# Altium schematic sheet 02_AFE.SchDoc
size Letter
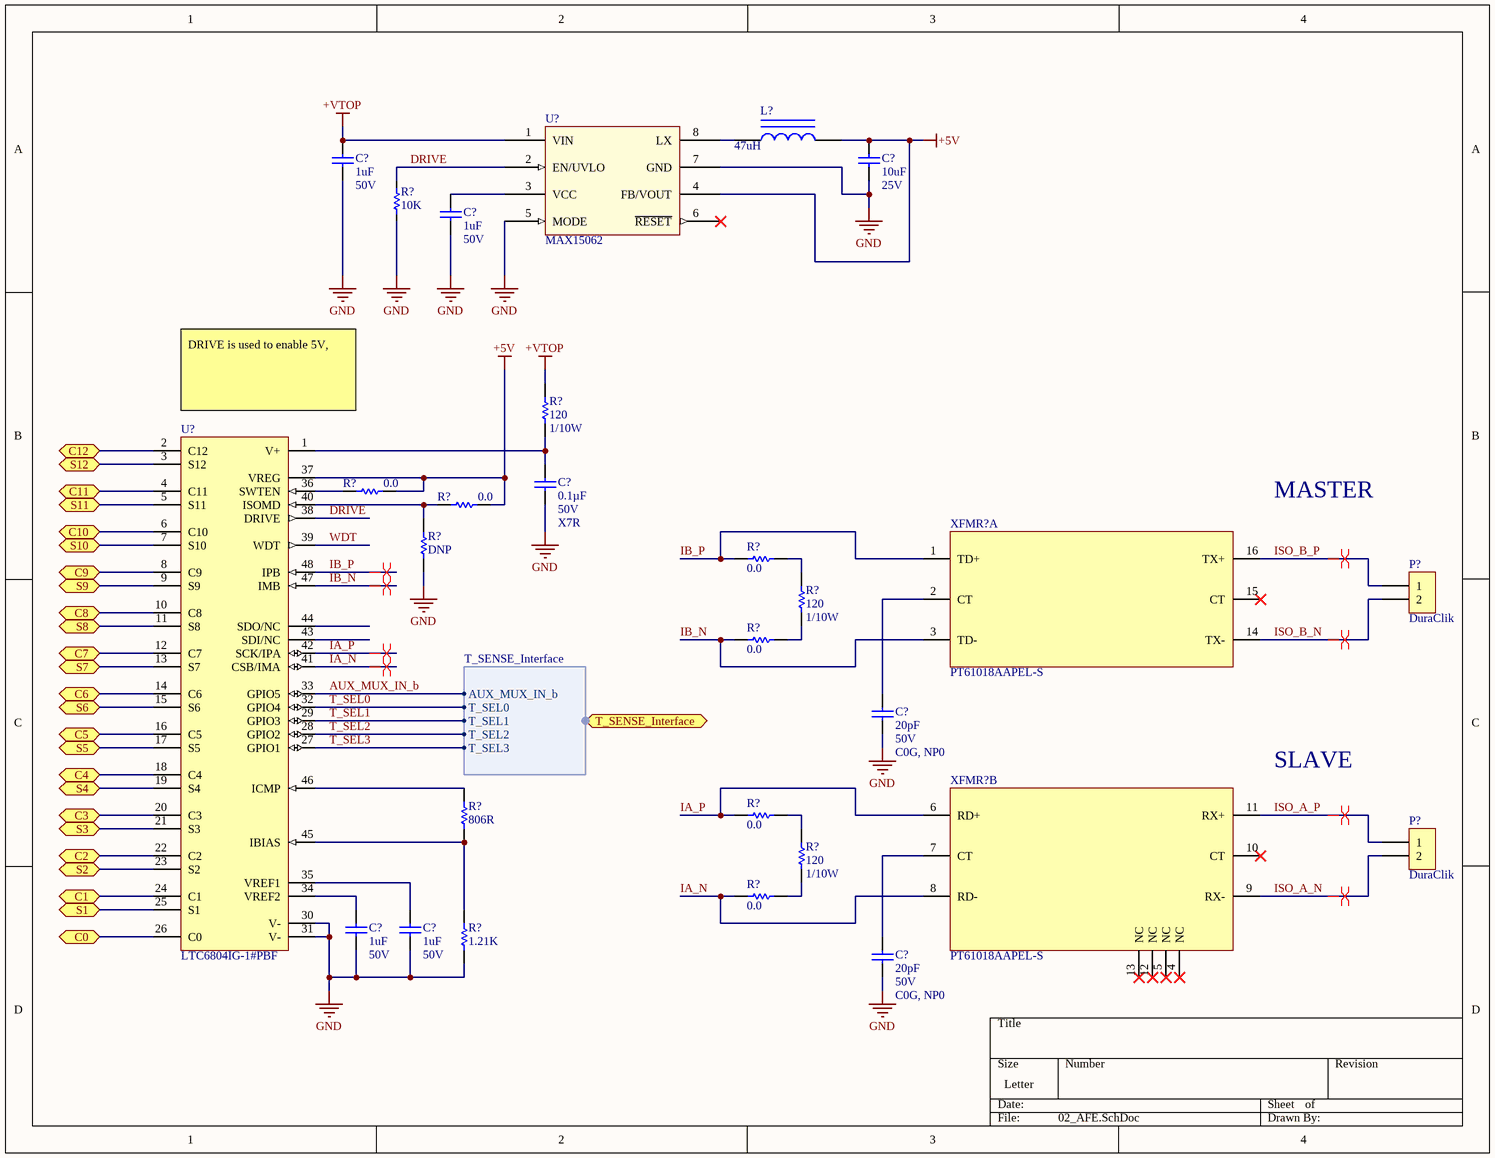
[diagram p0: 02_AFE.SchDoc]

## Parts
(Parts that share a designator on the sheet are numbered #1, #2 ... from top to bottom, then left to right.)
C?#1  1uF  Voltage: 50V  [CAPC1608X06N]
C?#2  10uF  Voltage: 25V  [CAPC1608X06N]
C?#3  1uF  Voltage: 50V  [CAPC1608X06N]
C?#4  Capacitance: 0.1µF  Voltage: 50V  Temperature Coefficient: X7R  [CAP, 0603]  (hidden comment: CAP CER 0.1UF 50V 10% X7R 0603)
C?#5  Capacitance: 20pF  Voltage: 50V  Temperature Coefficient: C0G, NP0  [CAP, 0603]  (hidden comment: CAP CER 20PF 50V ±5% C0G/NP0 0603)
C?#6  1uF  Voltage: 50V  [CAPC1608X06N]
C?#7  1uF  Voltage: 50V  [CAPC1608X06N]
C?#8  Capacitance: 20pF  Voltage: 50V  Temperature Coefficient: C0G, NP0  [CAP, 0603]  (hidden comment: CAP CER 20PF 50V ±5% C0G/NP0 0603)
L?  value 47uH  [AXIAL-0.9]  (hidden comment: nductor Iron)
P?#1  Series: DuraClik  [CONN, 2POS Dura-Click]  (hidden comment: CONN 2POS DURA-CLIK 0.079")
P?#2  Series: DuraClik  [CONN, 2POS Dura-Click]  (hidden comment: CONN 2POS DURA-CLIK 0.079")
R?#1  10K  [0805]
R?#2  Resistance: 120  Power: 1/10W  [RES, 0603]  (hidden comment: RES 120 OHM 1% 1/10W 0603)
R?#3  Resistance: 0.0  [RES, 0603]  (hidden comment: RES 0.0 OHM 1/4W 0603)
R?#4  Resistance: 0.0  [RES, 0603]  (hidden comment: RES 0.0 OHM 1/4W 0603)
R?#5  Resistance: 0.0  [RES, 0603]  (hidden comment: RES 0.0 OHM 1/4W 0603)
R?#6  Resistance: DNP  [RES, 0603]  (hidden comment: RES 0.0 OHM 1/4W 0603)
R?#7  Resistance: 120  Power: 1/10W  [RES, 0603]  (hidden comment: RES 120 OHM 1% 1/10W 0603)
R?#8  Resistance: 0.0  [RES, 0603]  (hidden comment: RES 0.0 OHM 1/4W 0603)
R?#9  Resistance: 0.0  [RES, 0603]  (hidden comment: RES 0.0 OHM 1/4W 0603)
R?#10  value 806R  [AXIAL-0.3]  (hidden comment: Res1)
R?#11  Resistance: 120  Power: 1/10W  [RES, 0603]  (hidden comment: RES 120 OHM 1% 1/10W 0603)
R?#12  Resistance: 0.0  [RES, 0603]  (hidden comment: RES 0.0 OHM 1/4W 0603)
R?#13  value 1.21K  [AXIAL-0.3]  (hidden comment: Res1)
U?#1  MAX15062
U?#2  Manufacturer Part Number 1: LTC6804IG-1#PBF  (hidden comment: IC MONITOR BATT STACK 48SSOP)
XFMR?#1  MFG_PN: PT61018AAPEL-S  [IC, PULSE XFMR 1CT:1CT 350UH SMD]  (hidden comment: IC PULSE XFMR 1CT:1CT 350UH SMD)  (part A of 2)
XFMR?#2  MFG_PN: PT61018AAPEL-S  [IC, PULSE XFMR 1CT:1CT 350UH SMD]  (hidden comment: IC PULSE XFMR 1CT:1CT 350UH SMD)  (part B of 2)

## Ports
C0, C1, C2, C3, C4, C5, C6, C7, C8, C9, C10, C11, C12, S1, S2, S3, S4, S5, S6, S7, S8, S9, S10, S11, S12, T_SENSE_Interface (harness T_SENSE_Interface)

## Harnesses
T_SENSE_Interface: AUX_MUX_IN_b, T_SEL0, T_SEL1, T_SEL2, T_SEL3

## Nets
+5V: C?#2.2 L?.2 R?#3.1 R?#4.2 U?#1.4(FB/VOUT) U?#2.37(VREG)
+VTOP: C?#1.2 R?#2.2 U?#1.1(VIN)
GND: C?#1.1 C?#2.1 C?#3.1 C?#4.2 C?#5.2 C?#6.1 C?#7.1 C?#8.2 R?#1.1 R?#6.1 R?#13.2 U?#1.5(MODE) U?#1.7(GND) U?#2.30(V-) U?#2.31(V-)
AUX_MUX_IN_b: U?#2.33(GPIO5) ; port T_SENSE_Interface.AUX_MUX_IN_b
C0: U?#2.26(C0) ; port C0
C1: U?#2.24(C1) ; port C1
C2: U?#2.22(C2) ; port C2
C3: U?#2.20(C3) ; port C3
C4: U?#2.18(C4) ; port C4
C5: U?#2.16(C5) ; port C5
C6: U?#2.14(C6) ; port C6
C7: U?#2.12(C7) ; port C7
C8: U?#2.10(C8) ; port C8
C9: U?#2.8(C9) ; port C9
C10: U?#2.6(C10) ; port C10
C11: U?#2.4(C11) ; port C11
C12: U?#2.2(C12) ; port C12
DRIVE: R?#1.2 U?#1.2(EN/UVLO) U?#2.38(DRIVE)
IA_N: R?#12.1 U?#2.41(CSB/IMA) XFMR?#2.8(RD-)
IA_P: R?#9.1 U?#2.42(SCK/IPA) XFMR?#2.6(RD+)
IB_N: R?#8.1 U?#2.47(IMB) XFMR?#1.3(TD-)
IB_P: R?#5.1 U?#2.48(IPB) XFMR?#1.1(TD+)
ISO_A_N: P?#2.2 XFMR?#2.9(RX-)
ISO_A_P: P?#2.1 XFMR?#2.11(RX+)
ISO_B_N: P?#1.2 XFMR?#1.14(TX-)
ISO_B_P: P?#1.1 XFMR?#1.16(TX+)
S1: U?#2.25(S1) ; port S1
S2: U?#2.23(S2) ; port S2
S3: U?#2.21(S3) ; port S3
S4: U?#2.19(S4) ; port S4
S5: U?#2.17(S5) ; port S5
S6: U?#2.15(S6) ; port S6
S7: U?#2.13(S7) ; port S7
S8: U?#2.11(S8) ; port S8
S9: U?#2.9(S9) ; port S9
S10: U?#2.7(S10) ; port S10
S11: U?#2.5(S11) ; port S11
S12: U?#2.3(S12) ; port S12
T_SEL0: U?#2.32(GPIO4) ; port T_SENSE_Interface.T_SEL0
T_SEL1: U?#2.29(GPIO3) ; port T_SENSE_Interface.T_SEL1
T_SEL2: U?#2.28(GPIO2) ; port T_SENSE_Interface.T_SEL2
T_SEL3: U?#2.27(GPIO1) ; port T_SENSE_Interface.T_SEL3
WDT: U?#2.39(WDT)
NetC?#3_2: C?#3.2 U?#1.3(VCC)
NetC?#4_1: C?#4.1 R?#2.1 U?#2.1(V+)
NetC?#5_1: C?#5.1 XFMR?#1.2(CT)
NetC?#6_2: C?#6.2 U?#2.34(VREF2)
NetC?#7_2: C?#7.2 U?#2.35(VREF1)
NetC?#8_1: C?#8.1 XFMR?#2.7(CT)
NetL?_1: L?.1 U?#1.8(LX)
NetR?#3_2: R?#3.2 U?#2.36(SWTEN)
NetR?#4_1: R?#4.1 R?#6.2 U?#2.40(ISOMD)
NetR?#5_2: R?#5.2 R?#7.1
NetR?#7_2: R?#7.2 R?#8.2
NetR?#9_2: R?#9.2 R?#11.1
NetR?#10_1: R?#10.1 R?#13.1 U?#2.45(IBIAS)
NetR?#10_2: R?#10.2 U?#2.46(ICMP)
NetR?#11_2: R?#11.2 R?#12.2

Not connected (* = marked no-connect by the designer): U?#1 6(~{RESET})*; U?#2 43(SDI/NC) 44(SDO/NC); XFMR?#1 15(CT)*; XFMR?#2 4(NC)* 5(NC)* 10(CT)* 12(NC)* 13(NC)*

## Layout directives
differential pair: IA_N, IA_P, IB_N, IB_P, ISO_A_N, ISO_A_P, ISO_B_N, ISO_B_P

## Notes on the sheet
- (near U?#2) DRIVE is used to enable 5V,
- MASTER
- SLAVE

## Library data of the parts
C?#1 C?#3 C?#6 C?#7 = CAP CER 1UF 50V 10% X7R 0603: 1µF ±10% 50V Ceramic Capacitor X7R 0603 (1608 Metric); Manufacturer: Taiyo Yuden; ManufacturerPartNumber: UMK107AB7105KA-T; Value: 1uF; Supplier 1: Digi-Key; Supplier Part Number 1: 587-3247-1-ND
C?#2 = CAP CER 10uF 25V 20% X5R 0603: 10µF ±20% 25V Ceramic Capacitor X5R 0603 (1608 Metric); Manufacturer: Murata Electronics North America; ManufacturerPartNumber: GRM188R61E106MA73D; Value: 10uF; Supplier: Digi-Key; SupplierPartNumber: 490-7202-1-ND
C?#4 = CAP CER 0.1UF 50V 10% X7R 0603: 0.10µF ±10% 50V Ceramic Capacitor X7R 0603 (1608 Metric); Manufacturer 1: AVX Corporation; Manufacturer Part Number 1: 06035C104KAT2A; Supplier 1: Digi-Key; Supplier Part Number 1: 478-5052-1-ND; Packaging: Cut Tape (CT); Part Status: Active; Operating Temperature: -55°C ~ 125°C; Ratings: -; Mounting Type: Surface Mount, MLCC; Package / Case: 0603 (1608 Metric); Size / Dimension: 0.063" L x 0.032" W (1.60mm x 0.81mm); Height - Seated (Max): -; Thickness (Max): 0.035" (0.90mm); Lead Spacing: -; Lead Style: -; ComponentLink1URL: http://datasheets.avx.com/X7RDielectric.pdf; ComponentLink1Description: http://datasheets.avx.com/X7RDielectric.pdf; Tolerance: ±10%
C?#5 C?#8 = CAP CER 20PF 50V ±5% C0G/NP0 0603: 20pF ±5% 50V Ceramic Capacitor C0G, NP0 0603 (1608 Metric); Manufacturer 1: Murata Electronics North America; Manufacturer Part Number 1: GRM1885C1H200JA01D; Supplier 1: Digi-Key; Supplier Part Number 1: 490-1410-1-ND; Packaging: Cut Tape (CT); Part Status: Active; Operating Temperature: -55°C ~ 125°C; Ratings: -; Mounting Type: Surface Mount, MLCC; Package / Case: 0603 (1608 Metric); Size / Dimension: 0.063" L x 0.031" W (1.60mm x 0.80mm); Height - Seated (Max): -; Thickness (Max): 0.035" (0.90mm); Lead Spacing: -; Lead Style: -; ComponentLink1URL: http://www.murata.com/~/media/webrenewal/support/library/catalog/products/capacitor/mlcc/c02e.ashx; ComponentLink1Description: http://www.murata.com/~/media/webrenewal/support/library/catalog/products/capacitor/mlcc/c02e.ashx; Tolerance: ±5%
L? = Inductor Iron: Magnetic-Core Inductor; Published: 24-Mar-1999; LatestRevisionDate: 17-Jul-2002; LatestRevisionNote: Re-released for DXP Platform.; PackageReference: AXIAL-0.9; Publisher: Altium Limited; PackageDescription: Axial Device, Thru-Hole; 2 Leads; 0.9 in Pin Spacing
P?#1 P?#2 = CONN 2POS DURA-CLIK 0.079": 2 Positions Header, Shrouded Connector 0.079" (2.00mm) Surface Mount, Right Angle Tin; Manufacturer 1: Molex, LLC; Manufacturer Part Number 1: 5023520200; Style: Board to Cable/Wire; Shrouding: Shrouded - 4 Wall; Number of Positions: 2; Number of Positions Loaded: All; Contact Length - Mating: 0.135" (3.45mm); Material Flammability Rating: UL94 V-0; Mated Stacking Heights: 11mm; Supplier 1: Digi-Key; Supplier Part Number 1: WM7169CT-ND; Packaging: Cut Tape (CT); Part Status: Active; Connector Type: Header; Contact Type: Male Pin; Number of Rows: 1; Row Spacing - Mating: -; Mounting Type: Surface Mount, Right Angle; Termination: Solder; Fastening Type: Latch Lock; Contact Length - Post: -; Overall Contact Length: -; Insulation Height: 0.252" (6.40mm); Contact Shape: Square; Contact Finish - Mating: Tin; Contact Finish Thickness - Mating: -; Contact Finish - Post: Tin; Contact Material: Copper Alloy; Insulation Material: Polyamide (PA), Nylon; Operating Temperature: -; Ingress Protection: -; Insulation Color: Natural; Current Rating: -; Contact Finish Thickness - Post: -; ComponentLink1URL: http://www.molex.com/pdm_docs/sd/5023520200_sd.pdf; ComponentLink1Description: http://www.molex.com/pdm_docs/sd/5023520200_sd.pdf; Voltage: -; Pitch - Mating: 0.079" (2.00mm)
R?#1 = RES 10K OHM 1/8W 5% 0805 SMD: ManufacturerPartNumber: CRCW080510K0JNEA; Manufacturer: Vishay Dale; Value: 10K; Supplier: Digi-Key; SupplierPartNumber: 541-10KACT-ND; Supplier 1: Digi-Key
R?#2 R?#7 R?#11 = RES 120 OHM 1% 1/10W 0603: RES SMD 120 OHM 1% 1/10W 0603; Manufacturer 1: Yageo; Manufacturer Part Number 1: RC0603FR-07120RL; Temperature Coefficient: ±100ppm/°C; Supplier 1: Digi-Key; Supplier Part Number 1: 311-120HRCT-ND; Packaging: Cut Tape (CT); Part Status: Active; Composition: Thick Film; Operating Temperature: -55°C ~ 155°C; Package / Case: 0603 (1608 Metric); Supplier Device Package: 0603; Size / Dimension: 0.063" L x 0.031" W (1.60mm x 0.80mm); Height - Seated (Max): 0.022" (0.55mm); Failure Rate: -; ComponentLink1URL: http://www.yageo.com/documents/recent/PYu-RC_Group_51_RoHS_L_7.pdf; ComponentLink1Description: http://www.yageo.com/documents/recent/PYu-RC_Group_51_RoHS_L_7.pdf; Tolerance: ±1%
R?#3-R?#6 R?#8 R?#9 R?#12 = RES 0.0 OHM 1/4W 0603: RES SMD 0.0 OHM JUMPER 1/4W 0603; Manufacturer 1: Vishay Dale; Manufacturer Part Number 1: CRCW06030000Z0EAHP; Supplier 1: Digi-Key; Supplier Part Number 1: 541-0.0SBCT-ND; Packaging: Cut Tape (CT); Part Status: Active; Composition: Thick Film; Operating Temperature: -55°C ~ 155°C; Package / Case: 0603 (1608 Metric); Supplier Device Package: 0603; Size / Dimension: 0.063" L x 0.033" W (1.60mm x 0.85mm); Height - Seated (Max): 0.022" (0.55mm); Failure Rate: -; ComponentLink1URL: http://www.vishay.com/docs/20043/crcwhpe3.pdf; ComponentLink1Description: http://www.vishay.com/docs/20043/crcwhpe3.pdf; Power (Watts): 1/4W
R?#10 R?#13 = Res1: Resistor; Published: 8-Jun-2000; LatestRevisionDate: 17-Jul-2002; LatestRevisionNote: Re-released for DXP Platform.; PackageReference: AXIAL-0.3; Publisher: Altium Limited; PackageDescription: Axial Device, Thru-Hole; 2 Leads; 0.3 in Pin Spacing
U?#1 = IC_REG_MAX15062: IC REG BUCK 5V 0.3A SYNC 8-TDFN; Manufacturer: Maxim Integrated; Manufacturer Part Number: MAX15062BATA+T; Digikey Part Number: MAX15062BATA+TCT-ND
U?#2 = IC MONITOR BATT STACK 48SSOP: Battery Battery Monitor IC Multi-Chemistry 48-SSOP; Manufacturer 1: Linear Technology; Number of Cells: 1 ~ 12; Fault Protection: Over/Under Voltage; Interface: I²C, SPI; Supplier 1: Digi-Key; Supplier Part Number 1: LTC6804IG-1#PBF-ND; Packaging: Tube; Part Status: Active; Function: Battery Monitor; Battery Chemistry: Multi-Chemistry; Operating Temperature: -40°C ~ 85°C (TA); Package / Case: 48-FSOP (0.209", 5.30mm Width); Supplier Device Package: 48-SSOP; ComponentLink1URL: http://www.linear.com/docs/43171; ComponentLink1Description: http://www.linear.com/docs/43171
XFMR?#1 XFMR?#2 = IC PULSE XFMR 1CT:1CT 350UH SMD: PULSE XFMR 1CT:1CT 350UH SMD; Manufacturer: Bourns Inc.; Isolation Voltage: 1.5kVrms; Supplier: Digikey; Supplier_PN: PT61018AAPEL-SCT-ND; Inductance: 350uH; Supplier 1: Digi-Key; Supplier Part Number 1: PT61018AAPEL-SCT-ND